# EAGLE design v3_stim+emg (EAGLE 7.1.0)
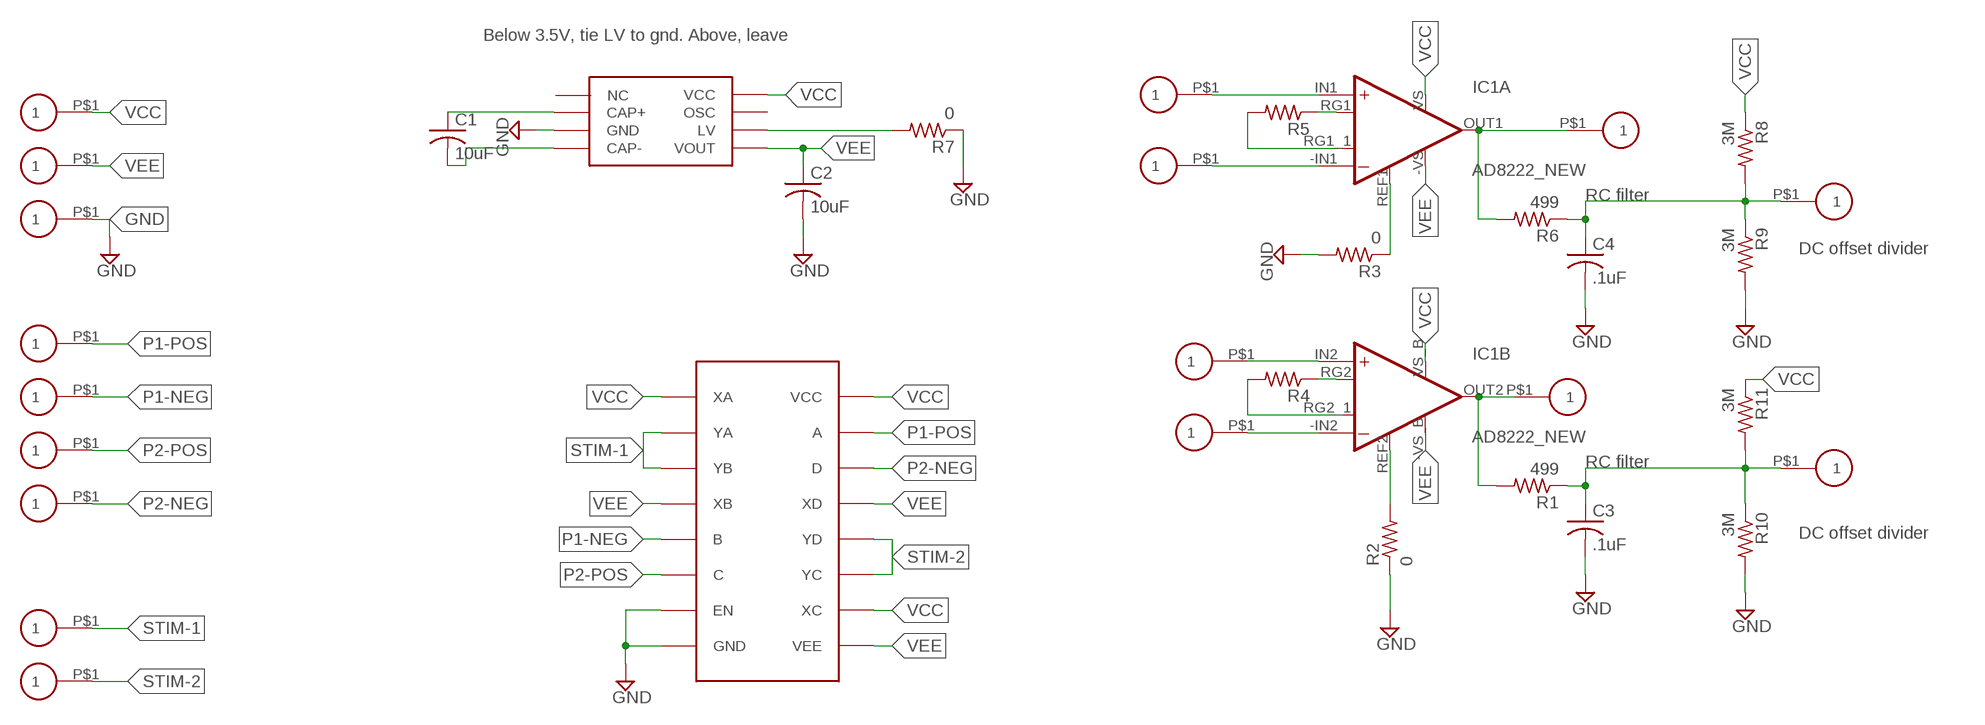
[diagram p0: schematic, sheet 1]

## Parts
A+  DBG_ELECTRODE  [DBG_ELECTRODE]
A-  DBG_ELECTRODE  [DBG_ELECTRODE]
A-OUT  DBG_ELECTRODE  [DBG_ELECTRODE]
B+  DBG_ELECTRODE  [DBG_ELECTRODE]
B-  DBG_ELECTRODE  [DBG_ELECTRODE]
B-OUT  DBG_ELECTRODE  [DBG_ELECTRODE]
C1  10uF  C-USC0402  [C0402]
C2  10uF  C-USC0402  [C0402]
C3  .1uF  C-USC0402  [C0402]
C4  .1uF  C-USC0402  [C0402]
EMG1  DBG_ELECTRODE  [DBG_ELECTRODE]
EMG2  DBG_ELECTRODE  [DBG_ELECTRODE]
GND  DBG_ELECTRODE  [DBG_ELECTRODE]
IC1  AD8222_NEW  [QFN-16]
P1-NEG  DBG_ELECTRODE  [DBG_ELECTRODE]
P1-POS  DBG_ELECTRODE  [DBG_ELECTRODE]
P2-NEG  DBG_ELECTRODE  [DBG_ELECTRODE]
P2-POS  DBG_ELECTRODE  [DBG_ELECTRODE]
R1  499  R-US_R0402  [R0402]
R2  0  R-US_R0402  [R0402]
R3  0  R-US_R0402  [R0402]
R4  R-US_R0402  [R0402]
R5  R-US_R0402  [R0402]
R6  499  R-US_R0402  [R0402]
R7  0  R-US_R0402  [R0402]
R8  3M  R-US_R0402  [R0402]
R9  3M  R-US_R0402  [R0402]
R10  3M  R-US_R0402  [R0402]
R11  3M  R-US_R0402  [R0402]
STIM-1  DBG_ELECTRODE  [DBG_ELECTRODE]
STIM-2  DBG_ELECTRODE  [DBG_ELECTRODE]
U$1  MC74HC4316A  [SOIC-16-ON-SEMI]
U$2  TL7660  [S-PDSO-G8]
VCC  DBG_ELECTRODE  [DBG_ELECTRODE]
VEE  DBG_ELECTRODE  [DBG_ELECTRODE]

## Nets
EMG1: C4.1 EMG1.P$1 R6.1 R8.2 R9.1
EMG2: C3.1 EMG2.P$1 R1.1 R10.1 R11.2
GND: C2.2 C3.2 C4.2 GND.P$1 R2.1 R3.2 R7.1 R9.2 R10.2 U$1.7(EN) U$1.8(GND) U$2.3(GND)
N$1: C1.1 U$2.2(CAP+)
N$2: C1.2 U$2.4(CAP-)
N$3: B+.P$1 IC1.IN2(B:+IN)
N$4: B-.P$1 IC1.-IN2(B:-IN)
N$5: R7.2 U$2.6(LV)
N$6: B-OUT.P$1 IC1.OUT2(B:OUT) R1.2
N$7: IC1.RG2(B:RG1) R4.1
N$8: IC1.RG2_1(B:RG1_1) R4.2
N$9: IC1.REF1(A:REF) R3.1
N$10: IC1.RG1(A:RG1) R5.1
N$11: IC1.RG1_1(A:RG1_1) R5.2
N$12: IC1.REF2(B:REF) R2.2
N$13: A-OUT.P$1 IC1.OUT1(A:OUT) R6.2
N$17: A+.P$1 IC1.IN1(A:+IN)
N$18: A-.P$1 IC1.-IN1(A:-IN)
P1-NEG: P1-NEG.P$1 U$1.5(B)
P1-POS: P1-POS.P$1 U$1.15(A)
P2-NEG: P2-NEG.P$1 U$1.14(D)
P2-POS: P2-POS.P$1 U$1.6(C)
STIM-1: STIM-1.P$1 U$1.2(YA) U$1.3(YB)
STIM-2: STIM-2.P$1 U$1.11(YC) U$1.12(YD)
VCC: IC1.VS(A:V+) IC1.VS_B(B:V+) R8.1 R11.1 U$1.1(XA) U$1.10(XC) U$1.16(VCC) U$2.8(VCC) VCC.P$1
VEE: C2.1 IC1.-VS(A:V-) IC1.-VS_B(B:V-) U$1.4(XB) U$1.9(VEE) U$1.13(XD) U$2.5(VOUT) VEE.P$1

## Notes on the sheet
- Below 3.5V, tie LV to gnd. Above, leave
- RC filter
- DC offset divider
- RC filter
- DC offset divider

## Power pins joined to a net without a drawn wire
NC: U$2.1(NC)
OSC: U$2.7(OSC)

## Library data of the parts
A+ A- A-OUT B+ B- B-OUT EMG1 EMG2 GND P1-NEG P1-POS P2-NEG P2-POS STIM-1 STIM-2 VCC VEE = moth:DBG_ELECTRODE
C1-C4 = rcl:C-US: CAPACITOR, American symbol
IC1 = moth:AD8222_NEW: OP AMP AD8222 Dual package instrumentation amplifier
R1-R11 = rcl:R-US_: RESISTOR, American symbol
U$1 = moth:MC74HC4316A
U$2 = moth:TL7660

## Board
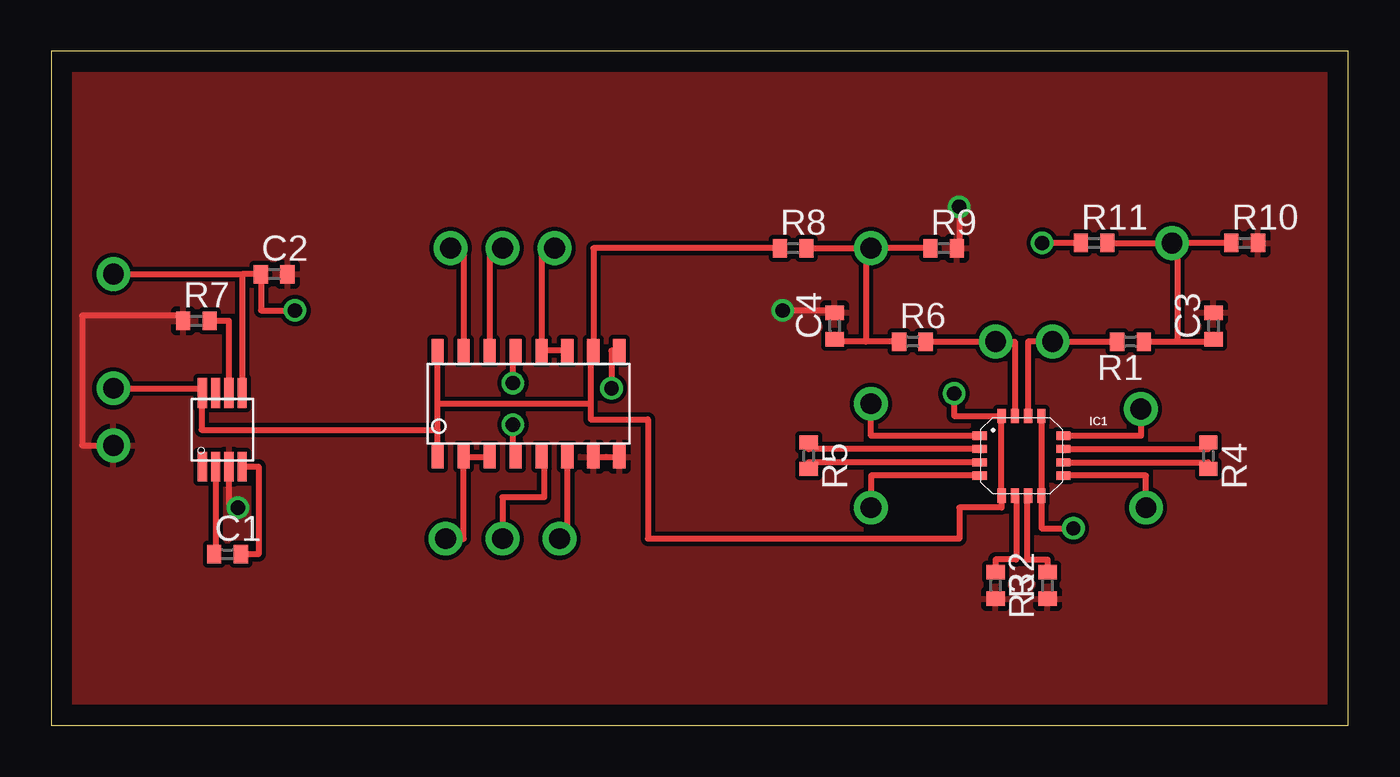
[diagram p1: board, top side]
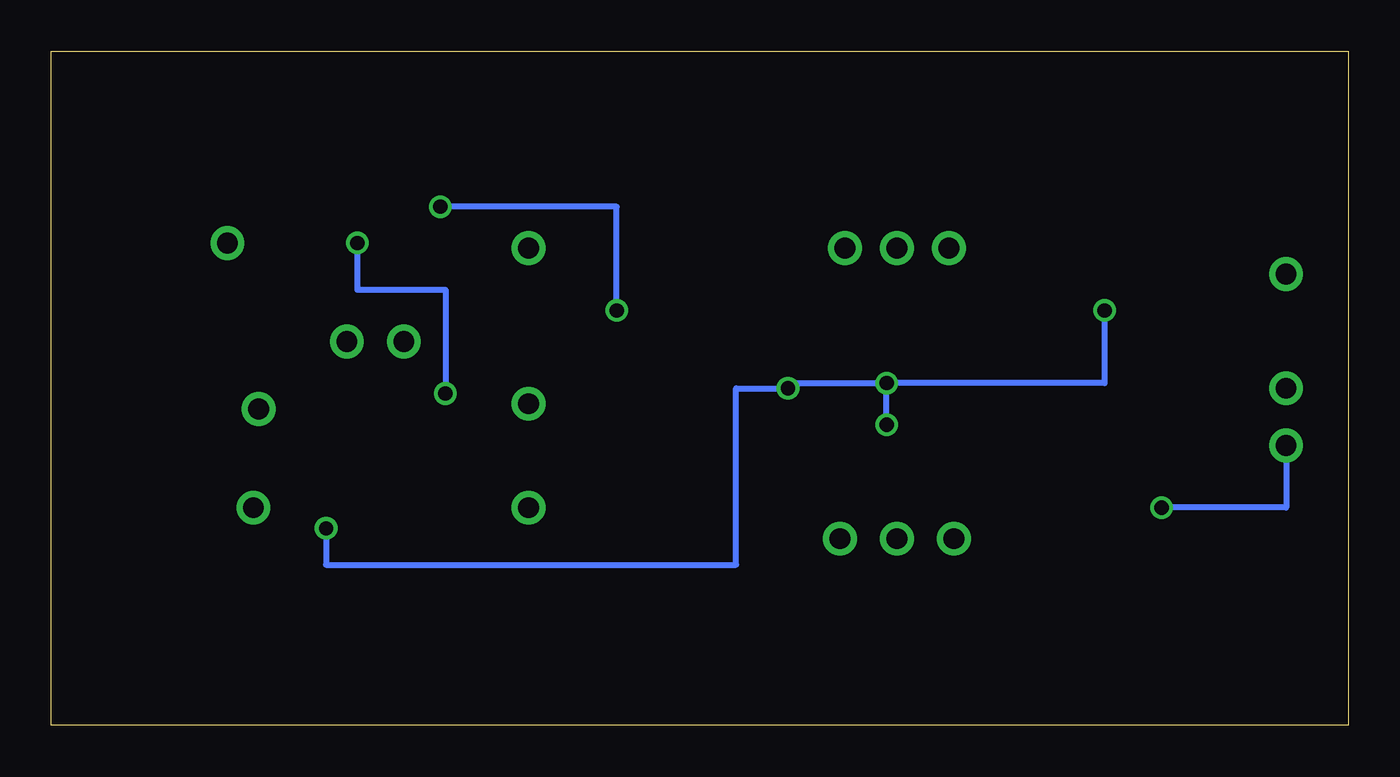
[diagram p2: board, bottom side, seen from below]

Size 63.5 x 33.02 mm. Coordinates in mm from the lower left corner, seen from the top.
Outline: 0,0 63.5,0 63.5,33.02 0,33.02 0,0
Copper layers (1*16): Top 0.035mm / dielectric 1.5mm / Bottom 0.035mm
Design rules "default": minimum track width 10mil, minimum drill 24mil, track to track 8mil, track to pad 8mil, pad to pad 8mil, via to via 8mil, smd to smd 8mil, copper to edge 40mil, drill to drill 8mil, minimum pad ring 10mil, minimum via ring 8mil, stop-mask expansion 4mil, vias tented up to drill 0mil, thermal gap 10mil

### Footprints (pad centres in the part's own frame; a part is rotated, then mirrored left to right if it is on the bottom)
DBG_ELECTRODE = drill 1.016 pad 1.651: P$1 0,0
C0402 = smd 0.7 x 0.9: 1 -0.65,0; 2 0.65,0
QFN-16 = smd 0.7 x 0.4: -IN1 -2.05,0.975; -IN2 2.05,0.975; IN1 -2.05,-0.975; IN2 2.05,-0.975; RG1 -2.05,0.325; RG1_1 -2.05,-0.325; RG2 2.05,0.325; RG2_1 2.05,-0.325 | smd 0.4 x 0.7: -VS 0.975,1.95; -VS_B 0.975,-1.95; OUT1 -0.325,1.95; OUT2 0.325,1.95; REF1 -0.325,-1.95; REF2 0.325,-1.95; VS -0.975,1.95; VS_B -0.975,-1.95
R0402 = smd 0.7 x 0.9: 1 -0.65,0; 2 0.65,0
SOIC-16-ON-SEMI = smd 0.6 x 1.15: 1 -4.445,-2.6; 2 -3.175,-2.6; 3 -1.905,-2.6; 4 -0.635,-2.6; 5 0.635,-2.6; 6 1.905,-2.6; 7 3.175,-2.6; 8 4.445,-2.6; 9 4.445,2.6; 10 3.175,2.6; 11 1.905,2.6; 12 0.635,2.6; 13 -0.635,2.6; 14 -1.905,2.6; 15 -3.175,2.6; 16 -4.445,2.6
S-PDSO-G8 = smd 0.45 x 1.45: 1 -0.975,-1.8; 2 -0.325,-1.8; 3 0.325,-1.8; 4 0.975,-1.8; 5 0.975,1.8; 6 0.325,1.8; 7 -0.325,1.8; 8 -0.975,1.8

### Placement (x,y rotation side)
A+  40.13,10.67 0 top
A-  40.13,15.75 0 top
A-OUT  46.23,18.8 0 top
B+  53.59,10.67 0 top
B-  53.34,15.49 0 top
B-OUT  49.02,18.8 0 top
C1  8.64,8.38 0 top
C2  10.92,22.1 0 top
C3  56.9,19.56 90 top
C4  38.35,19.56 90 top
EMG1  40.13,23.37 180 top
EMG2  54.86,23.62 180 top
GND  3.05,13.72 0 top
IC1  47.5,13.21 0 top
P1-NEG  22.1,9.14 0 top
P1-POS  19.56,23.37 0 top
P2-NEG  22.1,23.37 0 top
P2-POS  24.89,9.14 0 top
R1  52.83,18.8 180 top
R2  48.77,6.86 90 top
R3  46.23,6.86 270 top
R4  56.64,13.21 270 top
R5  37.08,13.21 270 top
R6  42.16,18.8 0 top
R7  7.11,19.81 0 top
R8  36.32,23.37 0 top
R9  43.69,23.37 0 top
R10  58.42,23.62 0 top
R11  51.05,23.62 0 top
STIM-1  19.3,9.14 0 top
STIM-2  24.64,23.37 0 top
U$1  23.37,15.75 0 top
U$2  8.38,14.48 0 top
VCC  3.05,16.51 0 top
VEE  3.05,22.1 0 top

### Tracks (layer width: path | path; a pad name or v marks a point on that pad's centre or on a via)
EMG1
  Top 0.305: R6.1 39.88,18.8 | 39.88,18.8 38.35,18.8 C4.1 | EMG1.P$1 39.88,23.37 39.88,18.8 | R8.2 EMG1.P$1 | R9.1 EMG1.P$1
EMG2
  Top 0.305: R1.1 55.12,18.8 | 55.12,18.8 56.9,18.8 C3.1 | EMG2.P$1 55.12,23.62 55.12,18.8 | R10.1 EMG2.P$1 | R11.2 EMG2.P$1
GND  (via drill 0.7)
  Top 0.305: v9.14,10.67 arc-90 8.71,10.85 U$2.3 | U$1.7 U$1.8 | R7.1 6.46,20.07 1.52,20.07 1.52,13.72 GND.P$1 | C4.2 38.35,20.32 v35.81,20.32 | v44.45,25.4 44.45,23.37 R9.2
  Bottom 0.305: GND.P$1 3.05,10.67 v9.14,10.67 | v35.81,20.32 35.81,25.4 v44.45,25.4
  pour Top: 0,0 0,33.02 63.5,33.02 63.5,0
N$1
  Top 0.305: U$2.2 8.06,8.38 C1.1
N$2
  Top 0.305: U$2.4 10.16,12.68 10.16,8.38 C1.2
N$3
  Top 0.305: B+.P$1 53.59,12.23 IC1.IN2
N$4
  Top 0.305: B-.P$1 53.34,14.18 IC1.-IN2
N$5
  Top 0.305: U$2.6 8.71,19.81 R7.2
N$6
  Top 0.305: IC1.OUT2 47.82,18.8 B-OUT.P$1 R1.2
N$7
  Top 0.305: IC1.RG2 56.64,13.53 R4.1
N$8
  Top 0.305: IC1.RG2_1 56.64,12.88 R4.2
N$9
  Top 0.305: IC1.REF1 47.24,11.26 47.24,8.13 46.23,8.13 R3.1
N$10
  Top 0.305: IC1.RG1 37.08,13.53 R5.1
N$11
  Top 0.305: IC1.RG1_1 37.08,12.88 R5.2
N$12
  Top 0.305: IC1.REF2 47.75,11.26 47.75,8.13 48.77,8.13 R2.2
N$13
  Top 0.305: R6.2 A-OUT.P$1 47.17,18.8 IC1.OUT1
N$17
  Top 0.305: IC1.IN1 40.13,12.23 A+.P$1
N$18
  Top 0.305: IC1.-IN1 40.13,14.18 A-.P$1
P1-NEG
  Top 0.305: U$1.5 24.13,13.15 24.13,11.18 22.1,11.18 P1-NEG.P$1
P1-POS
  Top 0.305: P1-POS.P$1 20.19,23.37 U$1.15
P2-NEG
  Top 0.305: P2-NEG.P$1 21.46,23.37 U$1.14
P2-POS
  Top 0.305: P2-POS.P$1 25.27,9.14 U$1.6
STIM-1
  Top 0.305: U$1.3 U$1.2 20.19,9.14 STIM-1.P$1
STIM-2
  Top 0.305: U$1.11 U$1.12 24,23.37 STIM-2.P$1
VCC  (via drill 0.7)
  Top 0.305: U$1.1 18.92,14.48 | 18.92,14.48 18.92,15.75 | 18.92,15.75 U$1.16 | 26.42,15.75 26.42,18.35 U$1.10 26.54,23.37 R8.1 | 26.42,15.75 18.92,15.75 | VCC.P$1 7.41,16.51 U$2.8 7.37,16.28 7.37,14.48 18.92,14.48 | 26.42,15.75 26.42,14.99 29.21,14.99 29.21,9.14 44.45,9.14 44.45,10.67 46.52,10.67 IC1.VS_B IC1.VS 44.2,15.16 v44.2,16.26 | R11.1 v48.51,23.62
  Bottom 0.305: v48.51,23.62 48.51,21.34 44.2,21.34 v44.2,16.26
VEE  (via drill 0.7)
  Top 0.305: 9.36,22.1 C2.1 10.27,20.32 v11.94,20.32 | 9.36,22.1 U$2.5 | U$1.9 27.43,18.35 v27.43,16.51 | VEE.P$1 9.36,22.1 | U$1.4 22.61,13.15 v22.61,14.73 | v22.61,16.76 22.61,18.35 U$1.13 | v50.04,9.65 48.47,9.65 IC1.-VS_B IC1.-VS
  Bottom 0.305: v22.61,14.73 v22.61,16.76 | v22.61,16.76 27.43,16.76 v27.43,16.51 29.97,16.51 29.97,7.87 50.04,7.87 v50.04,9.65 | v11.94,20.32 11.94,16.76 v22.61,16.76